# EAGLE design ADTWin (EAGLE 6.6.0)
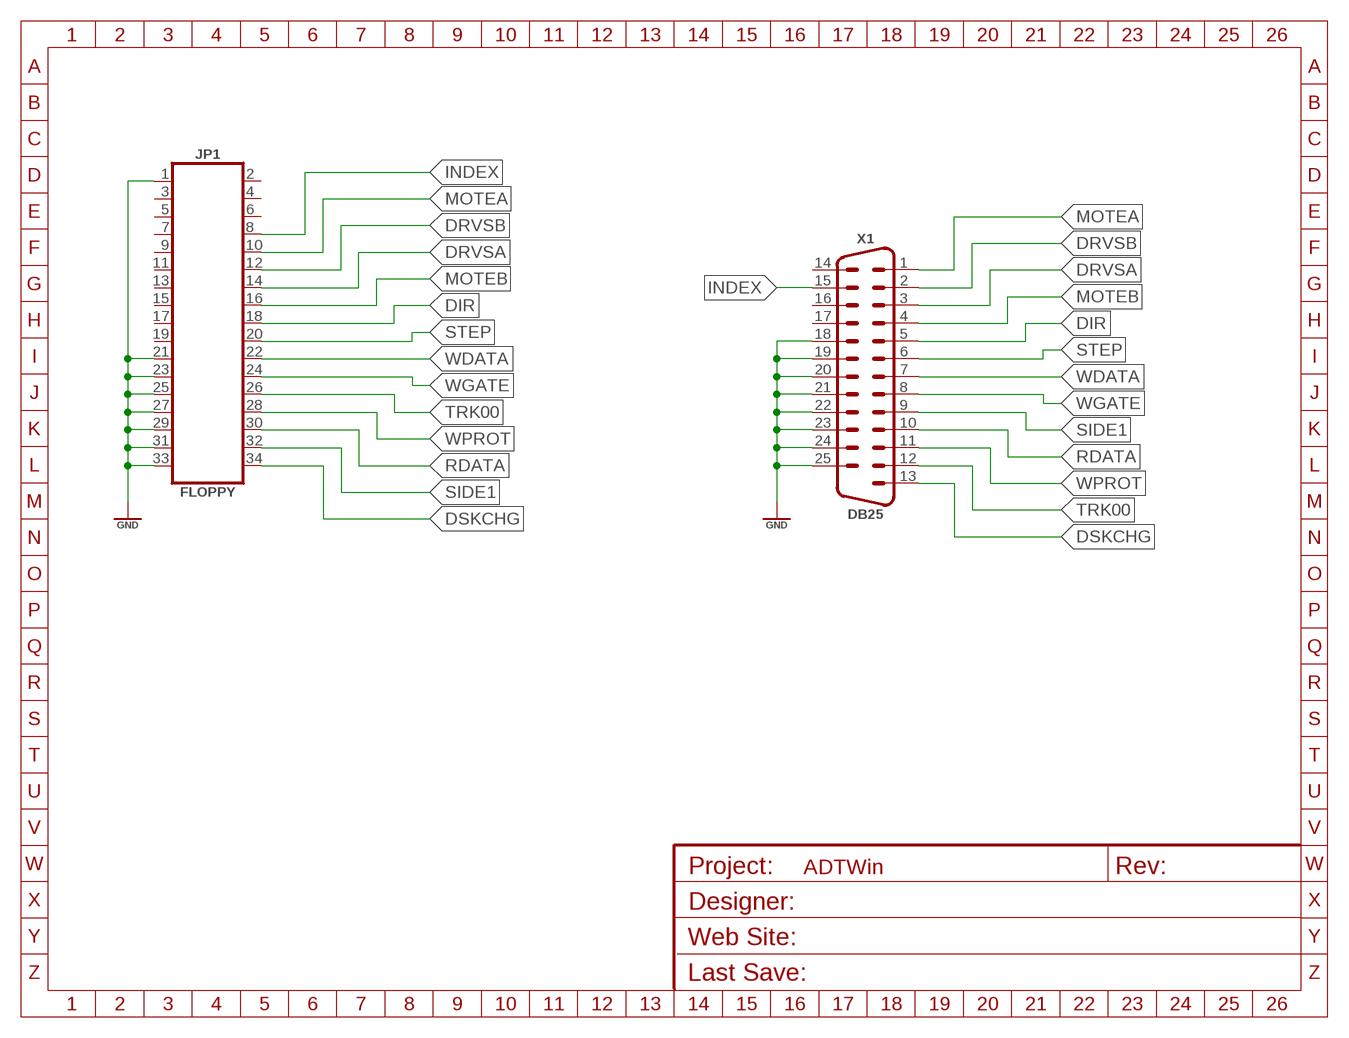
[diagram p0: schematic, sheet 1]
FRAME1 (A5L_FRAME): DESIGNER: Simon/CGTr; REVISION: 1.0; WEBSITE: http://www.commodore.gen.tr

## Parts
JP1  FLOPPY  [FLOPPY]
X1  DB25  DSUB25-SMD  [DSUB25-SMD]

## Nets
DIR: JP1.18 X1.5
DRVSA: JP1.14 X1.3
DRVSB: JP1.12 X1.2
DSKCHG: JP1.34 X1.13
GND: JP1.1 JP1.21 JP1.23 JP1.25 JP1.27 JP1.29 JP1.31 JP1.33 X1.18 X1.19 X1.20 X1.21 X1.22 X1.23 X1.24 X1.25
INDEX: JP1.8 X1.15
MOTEA: JP1.10 X1.1
MOTEB: JP1.16 X1.4
RDATA: JP1.30 X1.10
SIDE1: JP1.32 X1.9
STEP: JP1.20 X1.6
TRK00: JP1.26 X1.12
WDATA: JP1.22 X1.7
WGATE: JP1.24 X1.8
WPROT: JP1.28 X1.11
Unconnected: JP1.2 JP1.3 JP1.4 JP1.5 JP1.6 JP1.7 JP1.9 JP1.11 JP1.13 JP1.15 JP1.17 JP1.19 X1.14 X1.16 X1.17

## Library data of the parts
JP1 = sj_connectors:FLOPPY: 2x06 - 0.1" Floppy Header
X1 = sj_connectors:DSUB25: 25pin DSUB Connector

## Board
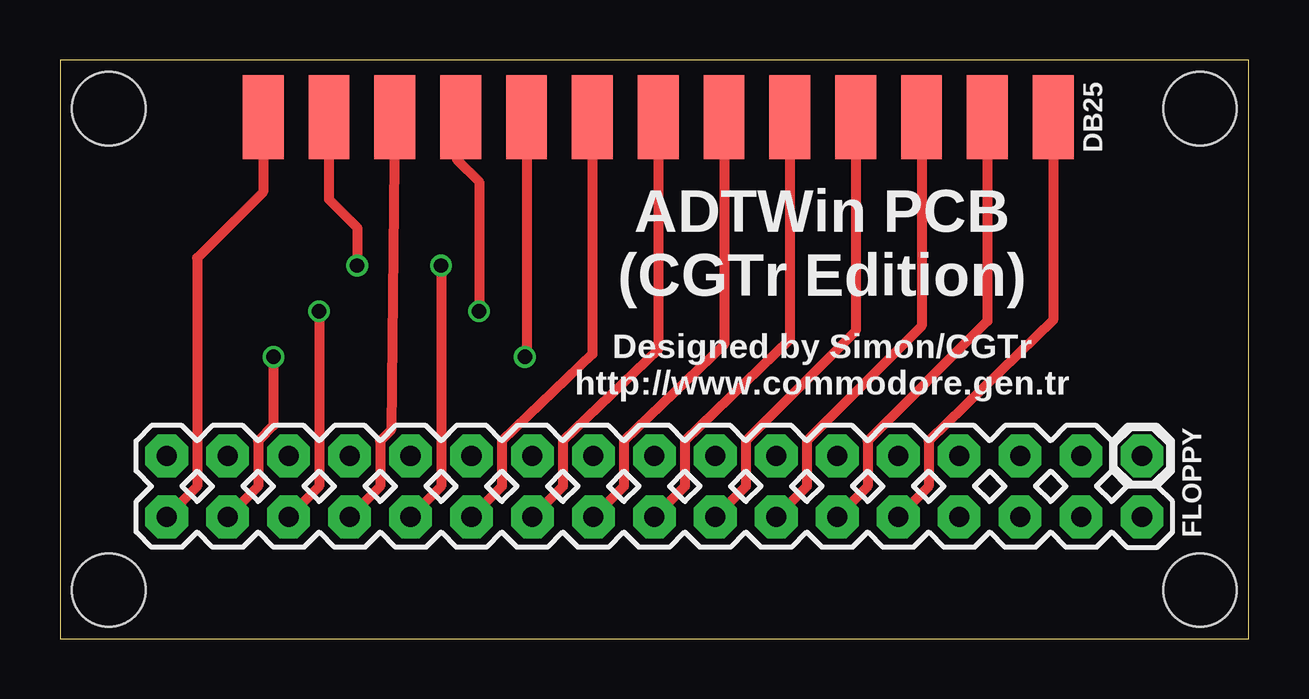
[diagram p1: board, top side]
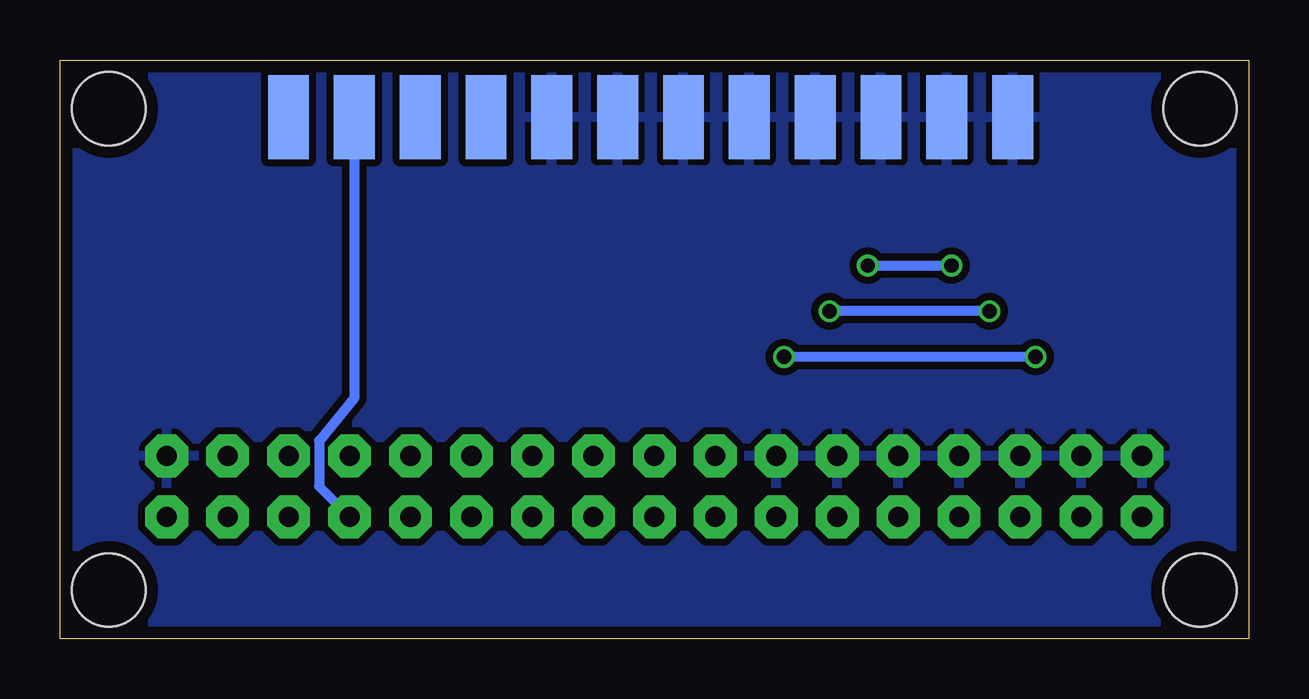
[diagram p2: board, bottom side, seen from below]

Size 49.53 x 24.13 mm. Coordinates in mm from the lower left corner, seen from the top.
Outline: 0,0 49.53,0 49.53,24.13 0,24.13 0,0
Copper layers (1*16): Top 0.035mm / dielectric 1.6mm / Bottom 0.035mm
Design rules "Elecrow": minimum track width 6mil, minimum drill 12mil, track to track 6mil, track to pad 6mil, pad to pad 6mil, via to via 8mil, smd to smd 0mil, copper to edge 20mil, drill to drill 10mil, minimum pad ring 6mil, minimum via ring 6mil, stop-mask expansion 0mil, vias tented up to drill 100mil, thermal gap 10mil
Holes 3.05 mm at 2.03,22.1 2.03,2.03 47.5,2.03 47.5,22.1

### Footprints (pad centres in the part's own frame; a part is rotated, then mirrored left to right if it is on the bottom)
FLOPPY = drill 0.838 pad 1.778 octagon: 1 0,0; 2 0,2.54; 3 2.54,0; 4 2.54,2.54; 5 5.08,0; 6 5.08,2.54; 7 7.62,0; 8 7.62,2.54; 9 10.16,0; 10 10.16,2.54; 11 12.7,0; 12 12.7,2.54; 13 15.24,0; 14 15.24,2.54; 15 17.78,0; 16 17.78,2.54; 17 20.32,0; 18 20.32,2.54; 19 22.86,0; 20 22.86,2.54; 21 25.4,0; 22 25.4,2.54; 23 27.94,0; 24 27.94,2.54; 25 30.48,0; 26 30.48,2.54; 27 33.02,0; 28 33.02,2.54; 29 35.56,0; 30 35.56,2.54; 31 38.1,0; 32 38.1,2.54; 33 40.64,0; 34 40.64,2.54
DSUB25-SMD = smd 1.7 x 3.5: 1 16.459,-1.917; 2 13.716,-1.917; 3 10.973,-1.917; 4 8.23,-1.917; 5 5.486,-1.917; 6 2.743,-1.917; 7 0,-1.917; 8 -2.743,-1.917; 9 -5.486,-1.917; 10 -8.23,-1.917; 11 -10.973,-1.917; 12 -13.716,-1.917; 13 -16.459,-1.917 | smd 1.7 x 3.5 bottom: 14 15.088,-1.918; 15 12.344,-1.918; 16 9.601,-1.918; 17 6.858,-1.918; 18 4.115,-1.918; 19 1.372,-1.918; 20 -1.372,-1.918; 21 -4.115,-1.918; 22 -6.858,-1.918; 23 -9.601,-1.918; 24 -12.344,-1.918; 25 -15.088,-1.918

### Placement (x,y rotation side)
JP1  45.09,7.62 180 top
X1  24.92,23.65 0 top

### Tracks (layer width: path | path; a pad name or v marks a point on that pad's centre or on a via)
DIR
  Top 0.406: X1.5 30.41,12.47 26.04,8.26 26.04,6.35 JP1.18
DRVSA
  Top 0.406: X1.3 35.9,13.04 31.11,8.26 31.11,6.35 JP1.14
DRVSB
  Top 0.406: X1.2 38.64,13.24 33.66,8.26 33.66,6.35 JP1.12
DSKCHG
  Top 0.406: JP1.34 5.71,6.35 5.71,15.88 8.46,18.62 X1.13
GND
  pour Bottom (isolate 0.305): 0,24.13 49.53,24.13 49.53,0 0,0
INDEX
  Bottom 0.406: X1.15 37.27,10.04 38.73,8.26 38.73,6.35 JP1.8
MOTEA
  Top 0.406: X1.1 41.38,13.28 36.2,8.26 36.2,6.35 JP1.10
MOTEB
  Top 0.406: X1.4 33.15,12.83 28.57,8.26 28.57,6.35 JP1.16
RDATA  (via drill 0.6)
  Top 0.406: v10.79,13.65 10.79,6.35 JP1.30 | X1.10 16.54,19.98 17.46,19.05 v17.46,13.65
  Bottom 0.406: v10.79,13.65 v17.46,13.65
SIDE1  (via drill 0.6)
  Top 0.406: JP1.32 8.26,6.35 8.26,8.26 8.89,8.89 v8.89,11.75 | X1.9 19.44,11.84 v19.37,11.75
  Bottom 0.406: v8.89,11.75 v19.37,11.75
STEP
  Top 0.406: X1.6 27.67,12.27 23.5,8.26 23.5,6.35 JP1.20
TRK00  (via drill 0.6)
  Top 0.406: v15.88,15.56 15.88,6.35 JP1.26 | X1.12 11.21,18.32 12.38,17.14 v12.38,15.56
  Bottom 0.406: v15.88,15.56 v12.38,15.56
WDATA
  Top 0.406: X1.7 24.92,12.06 20.95,8.26 20.95,6.35 JP1.22
WGATE
  Top 0.406: X1.8 22.18,11.86 18.41,8.26 18.41,6.35 JP1.24
WPROT
  Top 0.406: JP1.28 13.34,6.35 13.34,8.26 13.79,8.71 X1.11

### Text on the board
tNames: ADTWin PCB / (CGTr Edition) | Designed by Simon/CGTr / http://www.commodore.gen.tr